# Altium schematic sheet MD070B_POWER_AND_CONNECTORS.SchDoc
size 431 x 279 mm; Date: Not shown in title block; ApprovedBy: Not shown in title block; CheckedBy: Not shown in title block; Author: Not shown in title block; CompanyName: Not shown in title block; Engineer: Not shown in title block; Organization: Not shown in title block; Address1: Not shown in title block; Address2: Not shown in title block; Address3: Not shown in title block; Address4: Not shown in title block; DocumentNumber: 5; Revision: Use project parameter SCH_Rev; SheetNumber: 4; SheetTotal: 5; PageSetup: Record=PageOptions|CenterHorizontal=True|CenterVertical=True|PrintScale=1.00|XCorrection=1.00|YCorrection=1.00|PrintKind=0|BorderSize=5000000|LeftOffset=0|BottomOffset=0|Orientation=2|PaperLength=1000|PaperWidth=1000|Scale=100|PaperSource=15|PrintQuality=600|MediaType=1|DitherType=10|PaperKind=Letter|PrintScaleMode=1; CurrentTime: Not shown in title block; CurrentDate: Not shown in title block; Time: Not shown in title block; DocumentFullPathAndName: Not shown in title block; DocumentName: Not shown in title block; ModifiedDate: Not shown in title block; ImagePath: Not shown in title block
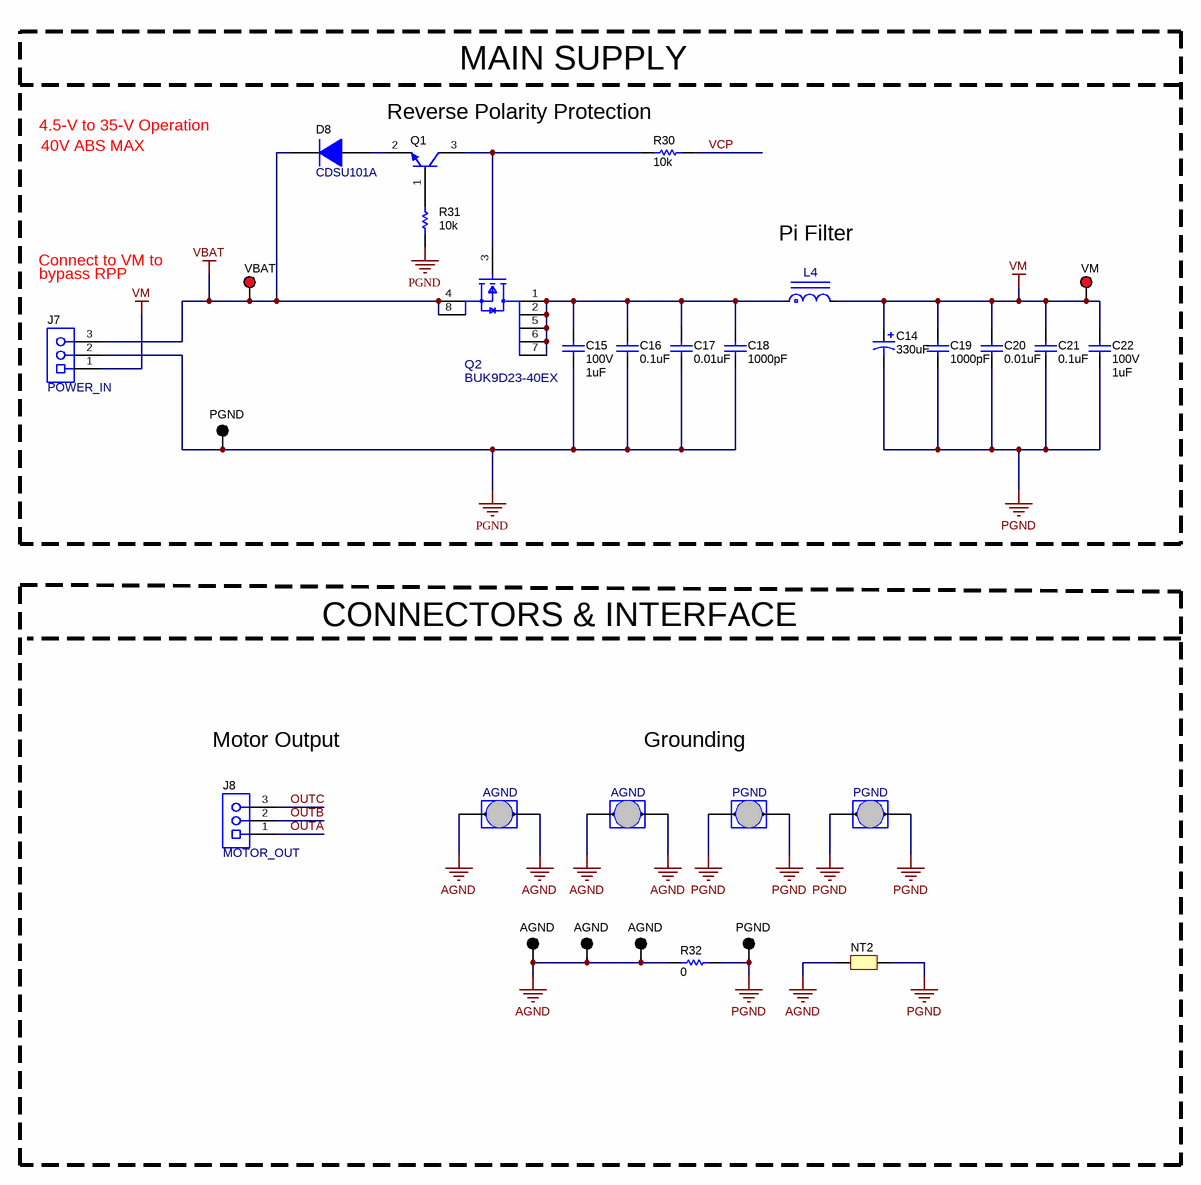
[diagram p0: MD070B_POWER_AND_CONNECTORS.SchDoc]

## Parts
C14  ValueDisplayed: 330uF  [Chemi-Con_1250x2000]  (hidden comment: ELXZ630ELL331MK20S)
C15  VDC_V: 100V  ValueDisplayed: 1uF  [1206_180]  (hidden comment: CL31B105KCHNNNE)
C16  ValueDisplayed: 0.1uF  [0603L]  (hidden comment: CGA3E3X7S2A104K080AB)
C17  ValueDisplayed: 0.01uF  [0603L]  (hidden comment: CGA3E2X7R2A103K080AA)
C18  ValueDisplayed: 1000pF  [0603L]  (hidden comment: CGA3E2X7R2A102K080AA)
C19  ValueDisplayed: 1000pF  [0603L]  (hidden comment: CGA3E2X7R2A102K080AA)
C20  ValueDisplayed: 0.01uF  [0603L]  (hidden comment: CGA3E2X7R2A103K080AA)
C21  ValueDisplayed: 0.1uF  [0603L]  (hidden comment: CGA3E3X7S2A104K080AB)
C22  VDC_V: 100V  ValueDisplayed: 1uF  [1206_180]  (hidden comment: CL31B105KCHNNNE)
D8  CDSU101A  [SOD-523F]
J7  POWER_IN  [On-Shore_ED120_3DS]
J8  MOTOR_OUT  [On-Shore_ED120_3DS]
L4  HCM1A1104V2-1R0-R  [FP-HCM1A1104V2-1R0-R_SMD2-MFG]  (value not drawn)
NT2  Net-Tie  [Net-Tie_50milWide_30milLong]  (value not drawn)  (net tie, no BOM)
Q1  FMMT620TA  [SOT-23L]  (value not drawn)
Q2  BUK9D23-40EX  [FP-BUK9D23-40EX_SOT1220-MFG]
R30  value 10k  [0603L]  (hidden comment: CRCW060310K0JNEA)
R31  value 10k  [0603L]  (hidden comment: CRCW060310K0JNEA)
R32  ValueDisplayed: 0  [1206L]  (hidden comment: RCA12060000ZSEA)
TP23  VBAT  [Keystone5005]
TP24  VM  [Keystone5005]
TP25  PGND  [Keystone5001]
TP26  AGND  [Harwin_D3082-05]
TP27  AGND  [Harwin_D3082-05]
TP28  PGND  [Harwin_D3082-05]
TP29  PGND  [Harwin_D3082-05]
TP30  AGND  [Keystone5001]
TP31  AGND  [Keystone5001]
TP32  AGND  [Keystone5001]
TP33  PGND  [Keystone5001]

## Blocks framed on the sheet
MAIN SUPPLY: C14-C22 D8 J7 L4 Q1 Q2 R30 R31 TP23-TP25
CONNECTORS & INTERFACE: J8 NT2 R32 TP26-TP33

## Nets
AGND: NT2.1 R32.1 TP26.1 TP26.2 TP27.1 TP27.2 TP30.1 TP31.1 TP32.1
PGND: C14.2(-) C15.2 C16.2 C17.2 C18.2 C19.2 C20.2 C21.2 C22.2 J7.2 NT2.2 R31.2 R32.2 TP25.1 TP28.1 TP28.2 TP29.1 TP29.2 TP33.1
VBAT: D8.1(K) J7.3 Q2.4(S) Q2.8(S) TP23.1
VM: C14.1(+) C19.1 C20.1 C21.1 C22.1 J7.1 L4.2 TP24.1
OUTA: J8.1
OUTB: J8.2
OUTC: J8.3
VCP: R30.1
NetC15_1: C15.1 C16.1 C17.1 C18.1 L4.1 Q2.1(D) Q2.2(D) Q2.5(D) Q2.6(D) Q2.7(D)
NetD8_2: D8.2(A) Q1.2(E)
NetQ1_1: Q1.1(B) R31.1
NetQ1_3: Q1.3(C) Q2.3(G) R30.2

## Notes on the sheet
- 40V ABS MAX
- 4.5-V to 35-V Operation
- Reverse Polarity Protection
- bypass RPP
- Connect to VM to
- Pi Filter
- Motor Output
- Grounding
- Drawn By:
- SVN Rev:
- Number:
- TID #:
- Orderable:
- Rev:
- Sheet Title:
- File:
- Project Title:
- Designed for:
- Assembly Variant:
- Mod. Date:
- Sheet:
- Size:
- of
- B
- http://www.ti.com
- Texas Instruments and/or its licensors do not warrant the accuracy or completeness of this specification or any information contained therein. Texas Instruments and/or its licensors do not warrant that this design will meet the specifications, will be suitable for your application or fit for any particular purpose, or will operate in an implementation. Texas Instruments and/or its licensors do not warrant that the design is production worthy. You should completely validate and test your design implementation to confirm the system functionality for your application.
- Engineer:
- Contact:
- © Texas Instruments

## Library data of the parts
C14 = CMP-0009912-2: CAP, AL, 330 uF, 63 V, +/- 20%, AEC-Q200 Grade 2, TH; Manufacturer: Chemi-Con; Polarized: Y; CompType: Capacitor; Value: 330uF; U/M: EA; Cap_F: 330µF; Value1: Unknown; VDC_V: 63V; IRMS_A: 1.29A; TaMin_C: -55°C; TaMax_C: 105°C; Cap_Case: 12.5x20mm; AEC Category: Q200; AEC Grade: 2; SizeAreaWB_mm2: 210.25; SizeArea_mm2: 156.25; SizeX_mm: 12.5; SizeZ_mm: 21.5; PartNumber: ELXZ630ELL331MK20S; PackageReference: D12.5xL20mm; RoHS: Y; Tolerance_%: 20%; Value2: 63V; MountType: TH; Technology: AL; Series: LXZ; Publisher: Texas Instruments; LatestRevisionDate: 2017-03-09; ComponentLink1Description: Datasheet link; ComponentLink1URL: http://www.chemi-con.co.jp/cgi-bin/CAT_DB/SEARCH/cat_db_al.cgi?e=e&j=p&pdfname=lxz; Supplier 1: Digi-Key; Supplier Part Number 1: 565-2043-ND; Supplier 2: Mouser; Supplier Part Number 2: 661-ELXZ630ELL331MK2; AEC Qualified: Y; SizeY_mm: 12.5
C15 C22 = CMP-0008801-2: CAP, CERM, 1 uF, 100 V, +/- 10%, X7R, 1206; Manufacturer: Samsung; TaMin_C: -55°C; Polarized: N; SizeAreaWB_mm2: 10.92; Value1: Unknown; U/M: EA; Value: 1uF; TaMax_C: 125°C; SizeZ_mm: 1.8; SizeX_mm: 3.2; SizeY_mm: 1.6; Cap_Case: 1206; SizeArea_mm2: 5.12; Cap_F: 1µF; AEC Category: Q200; Publisher: Texas Instruments; TempCo: X7R; Published: 2008-06-19; RoHS: Y; MountType: SMT; Supplier 1: Digi-Key; PackageReference: 1206; Tolerance_%: 10%; Value2: 100V; CompType: Capacitor; LatestRevisionDate: 2017-03-09; PartNumber: CL31B105KCHNNNE; AEC Qualified: N; ComponentLink1Description: Datasheet link; AEC Grade: N/A; Supplier Part Number 1: 1276-1838-1-ND; Technology: Ceramic; ComponentLink1URL: http://www.samsungsem.com/kr/front/downloadcms.do?path=/kr/support/product-search/mlcc/__icsFiles/afieldfile/2014/11/05&fileName=C_CL31B105KCHNNNE.pdf
C16 C21 = CMP-0007099-4: CAP, CERM, 0.1 uF, 100 V, +/- 10%, X7S, AEC-Q200 Grade 1, 0603; Manufacturer: TDK; Polarized: N; Value: 0.1uF; U/M: EA; Cap_F: 100nF; ESR_ohm: 0.04959; Value1: 0.04959 ohm; VDC_V: 100V; IRMS_A: 751.618mA; TaMin_C: -55°C; TaMax_C: 125°C; Cap_Case: 0603; AEC Category: Q200; AEC Qualified: Y; AEC Grade: 1; SizeAreaWB_mm2: 4.68; SizeX_mm: 1.6; SizeY_mm: 0.8; SizeArea_mm2: 1.28; CompType: Capacitor; PartNumber: CGA3E3X7S2A104K080AB; PackageReference: 0603; RoHS: Y; Tolerance_%: 10%; Value2: 100V; MountType: SMT; Technology: Ceramic; TempCo: X7S; Published: 2008-06-19; Publisher: Texas Instruments; LatestRevisionDate: 2017-03-09; ComponentLink1Description: Datasheet link; ComponentLink1URL: https://product.tdk.com/en/search/capacitor/ceramic/mlcc/info?part_no=CGA3E3X7S2A104K080AB; Supplier 1: Digi-Key; Supplier Part Number 1: 445-6938-1-ND; Supplier 2: Newark; Supplier Part Number 2: 04X3163; Supplier 3: Mouser; Supplier Part Number 3: 810-CGA3E3X7S2A104K; SizeZ_mm: 1
C17 C20 = CMP-0007082-4: CAP, CERM, 0.01 uF, 100 V, +/- 10%, X7R, AEC-Q200 Grade 1, 0603; Manufacturer: TDK; Polarized: N; Value: 0.01uF; U/M: EA; Cap_F: 10nF; ESR_ohm: 0.235428; Value1: 0.235428 ohm; VDC_V: 100V; IRMS_A: 396.995mA; TaMin_C: -55°C; TaMax_C: 125°C; Cap_Case: 0603; AEC Category: Q200; AEC Qualified: Y; AEC Grade: 1; SizeArea_mm2: 1.28; SizeAreaWB_mm2: 4.68; SizeX_mm: 1.6; SizeY_mm: 0.8; CompType: Capacitor; PartNumber: CGA3E2X7R2A103K080AA; PackageReference: 0603; RoHS: Y; Tolerance_%: 10%; Value2: 100V; MountType: SMT; Technology: Ceramic; TempCo: X7R; Published: 2008-06-19; Publisher: Texas Instruments; LatestRevisionDate: 2017-03-09; ComponentLink1Description: Datasheet link; ComponentLink1URL: https://product.tdk.com/en/search/capacitor/ceramic/mlcc/info?part_no=CGA3E2X7R2A103K080AA; Supplier 1: Digi-Key; Supplier Part Number 1: 445-5812-1-ND; Supplier 2: Mouser; Supplier Part Number 2: 810-CGA3E2X7R2A103K080AA; SizeZ_mm: 1
C18 C19 = CMP-0007081-4: CAP, CERM, 1000 pF, 100 V, +/- 10%, X7R, AEC-Q200 Grade 1, 0603; Manufacturer: TDK; Polarized: N; Value: 1000pF; U/M: EA; Cap_F: 1nF; ESR_ohm: 1.97137; Value1: 1.97137 ohm; VDC_V: 100V; IRMS_A: 305.705mA; TaMin_C: -55°C; TaMax_C: 125°C; Cap_Case: 0603; AEC Category: Q200; AEC Qualified: Y; AEC Grade: 1; SizeArea_mm2: 1.28; SizeAreaWB_mm2: 4.68; SizeX_mm: 1.6; SizeY_mm: 0.8; CompType: Capacitor; PartNumber: CGA3E2X7R2A102K080AA; PackageReference: 0603; RoHS: Y; Tolerance_%: 10%; Value2: 100V; MountType: SMT; Technology: Ceramic; TempCo: X7R; Published: 2008-06-19; Publisher: Texas Instruments; LatestRevisionDate: 2017-03-09; ComponentLink1Description: Datasheet link; ComponentLink1URL: https://product.tdk.com/en/search/capacitor/ceramic/mlcc/info?part_no=CGA3E2X7R2A102K080AA; Supplier 1: Digi-Key; Supplier Part Number 1: 445-5806-1-ND; Supplier 2: Mouser; Supplier Part Number 2: 810-CGA3E2X7R2A102K080AA; SizeZ_mm: 1
D8 = CMP-0076943-3: Diode, Switching, 90 V, 0.1 A, SOD-523F; Manufacturer: Comchip Technology; SizeAreaWB_mm2: 5.13; Vr_V: 90V; SizeArea_mm2: 1.53; TJmax_C: 125°C; AEC Category: Q101; Value: 90V; SizeZ_mm: 0.85; Green_REACh: Incomplete; Io_A: 100mA; Vf_V: 1V; SizeY_mm: 0.9; Green_Lifecycle: Not Set; Value1: 0.1A; SizeX_mm: 1.7; MFG_Status: TI_Obsolete; ComponentLink1Description: Datasheet link; RoHS: Y; AEC Qualified: ?; Green_EU RoHS: Incomplete; PackageReference: SOD-523F; PartNumber: CDSU101A; Value2: 1V; ComponentLink1URL: http://www.comchiptech.com/cms/UserFiles/CDSU101A-RevA371622.pdf; CompType: Diode; MountType: SMT; Type: Switching; Green_EU RoHS-2: Incomplete
J7 J8 = CMP-0074911-1: Terminal Block, 5.08 mm, 3x1, Brass, TH; Manufacturer: On-Shore Technology; PartNumber: ED120/3DS; Cert_VDE: Y; CNHeader: False; Current_A: 15A; Green_Lifecycle: Not Set; Shrouded: N; Gender: Female; Green_REACh: Incomplete; Voltage_V: 300V; Row_Count: 1; Pitch_mm: 5.08; CT: True; ComponentLink1URL: http://www.on-shore.com/sites/default/files/manuals/ed120ds.pdf; Publisher: Texas Instruments; Color: Blue; Cert_CULUS: Y; RoHS: Y; MountType: TH; Green_EU RoHS-2: Incomplete; Supplier 1: Digi-Key; Green_EU RoHS: Incomplete; PackageReference: 3x1 5.08 mm Terminal Block; PinCount: 3; CompType: Terminal Block; LatestRevisionDate: 2017-07-12; Orientation: Vertical; ComponentLink1Description: Datasheet URL; Supplier Part Number 1: ED1610-ND; ContactFinish: Brass
L4 = CMP-0094173-1: 1 µH Shielded - Inductor 19 A 3.1mOhm Max Nonstandard; Manufacturer: Eaton; Isat: 25A; Irms: 19A; DCR_ohm: 3.1m; Material: Alloy powder; Value: 1uH; SizeZ_mm: 4mm; Ind_H: 1µH; AEC Qualified: Yes; AEC Grade: Grade 0; Shrouded: true; Test Frequency: 100kHz; Self Resonant Frequency: 38MHz; Tolerance_%: 20%; ComponentLink1URL: https://www.eaton.com/content/dam/eaton/products/electronic-components/resources/data-sheet/eaton-hcm1a1104v2-automotive-power-inductors-data-sheet.pdf; RoHS: TRUE; PackageReference: SMD2; PartNumber: HCM1A1104V2-1R0-R; ComponentLink1Description: Datasheet; Supplier 1: Digikey; Supplier 2: Mouser; Supplier Part Number 1: 283-HCM1A1104V2-1R0-RCT-ND; Supplier Part Number 2: 504-HCM1A1104V21R0-R; Part Number: HCM1A1104V2-1R0-R; Operating Temperature Range: -55°C to +155°C; datasheet: https://www.eaton.com/content/dam/eaton/products/electronic-components/resources/data-sheet/eaton-hcm1a1104v2-automotive-power-inductors-data-sheet.pdf; Lead Free: Yes; Digikey Part Number: 283-HCM1A1104V2-1R0-RCT-ND; helpURL: https://upverter.com/upn/revision/8b90632ea16fe584/; Digikey Description: FIXED IND 1UH 19A 3.1 MOHM SMD; Mouser Part Number: 504-HCM1A1104V21R0-R; Datasheet Path: datasheets/Ind-HCM1A1104V2-1R0-R.pdf
NT2 = CMP-0078142-4: Single point connection between nets.; CompType: Net-Tie; PackageReference: N/A; Library Reference: Net-Tie; Manufacturer: N/A; PartNumber: N/A; MountType: SMT
Q1 = CMP-0000467-2: Transistor, NPN, 80 V, 1.5 A, AEC-Q101, SOT-23; Manufacturer: Diodes Inc.; TaMax_C: 150°C; Value2: 900; Value1: 1.5 A; Vcesat1_V: 160mV; SizeX_mm: 2.5; SizeY_mm: 3; TaMin_C: -55°C; IcRated_A: 1.5A; CompType: BJT; SizeZ_mm: 1.1; AEC Qualified: Y; Value: 80 V; SizeArea_mm2: 7.5; NPN: 1; Vceo_V: 80V; PNP: 0; AEC Category: Q101; SizeAreaWB_mm2: 14; U/M: EA; Supplier 2: Newark; Supplier 3: Mouser; Supplier 1: Digi-Key; Supplier Part Number 1: FMMT620CT-ND; Supplier Part Number 2: 65T9129; Supplier Part Number 3: 522-FMMT620TA; PartNumber: FMMT620TA; LatestRevisionDate: 2017-03-09; ComponentLink1URL: http://www.diodes.com/datasheets/FMMT620.pdf; Publisher: Texas Instruments; ComponentLink1Description: Datasheet link; HfeMax: 900; Published: 2008-07-31; RoHS: Y; PackageReference: SOT-23; MountType: SMT
Q2 = CMP-0088880-1: N-Channel 40V 8A (Ta) 15W (Tc) Surface Mount DFN2020MD-6; Manufacturer: Nexperia; Reverse Recovery Charge: 5.3nC; Vgs_V: 15V; Rthja Max: 57K/W; Number Of N Channels: 1; Pulse Drain Current: 76A; Threshold Vgs Max: 2.1V; Power_W: 2.3W; Reverse Recovery Time: 12.9ns; TaMin_C: -55°C; Rdson45_ohm: 0.018; SizeZ_mm: 0.65mm; ChMode: False; Transconductance: 39S; AEC Qualified: Yes; Typ Forward Diode Voltage: 0.8V; Turn Off Delay Time: 12ns; TaMax_C: +175°C; Input Capacitace At Vds: 637pF @ 20V; QgTyp_nC: 11.5nC @ 10V; Threshold Vgs Min: 1.4V; AEC Grade: Grade 0; VdsMax_V: 1.2V; Turn On Delay Time: 2ns; Device Class L1: Discrete Semiconductors; PartNumber: BUK9D23-40EX; PackageReference: SOT1220; Digikey Description: MOSFET N-CH 40V 8A 6DFN2020MD; Mouser Part Number: 771-BUK9D23-40EX; RoHS: TRUE; Device Class L2: Transistors; ComponentLink1URL: https://assets.nexperia.com/documents/data-sheet/BUK9D23-40E.pdf; Lead Free: Yes; IdsMax_A: 8A; ComponentLink1Description: Datasheet; Operating Temperature Range: -55°C to +175°C; Digikey Part Number: 1727-7413-1-ND; datasheet: https://assets.nexperia.com/documents/data-sheet/BUK9D23-40E.pdf; Part Number: BUK9D23-40EX; Number Of Channels: 1; Datasheet Path: datasheets/Trans-BUK9D23-40EX.pdf; helpURL: https://upverter.com/upn/revision/bf3b926f6919405d/; Device Class L3: MOSFETs; Drain To Source Breakdown Voltage: 40V; TJmax_C: +175°C
R30 R31 = CMP-0025701-4: RES, 10 k, 5%, 0.1 W, AEC-Q200 Grade 0, 0603; Manufacturer: Vishay-Dale; Value_Code: 10k0; Power_W: 100mW; Value2: 0.1W; VDC_V: 75V; TempCo: 200 ppm/C; EIA_Code: E24; AEC Category: Q200; AEC Qualified: Y; AEC Grade: 0; SizeArea_mm2: 1.28; SizeX_mm: 1.6; SizeY_mm: 0.8; SizeZ_mm: 1; CompType: Resistor; PartNumber: CRCW060310K0JNEA; PackageReference: 0603; RoHS: E; Res_ohm: 10k; Tolerance_%: 5%; Value1: 5%; MountType: SMT; Technology: Thick Film; ComponentLink1Description: Datasheet link; ComponentLink1URL: http://www.vishay.com/docs/20035/dcrcwe3.pdf; Supplier 1: Digi-Key; Supplier Part Number 1: 541-10KGCT-ND; Supplier 2: Newark; Supplier Part Number 2: 52K8066; Supplier 3: Mouser; Supplier Part Number 3: 71-CRCW0603J-10K-E3; ValueDisplayed: 10k
R32 = CMP-0018760-2: RES, 0, 5%, 0.25 W, AEC-Q200 Grade 0, 1206; Manufacturer: Vishay-Dale; Power_W: 250mW; TempCo: ppm/C; Value_Code: 0000; U/M: EA; Value: 0; EIA_Code: E24; SizeX_mm: 3.2; SizeY_mm: 1.6; SizeZ_mm: 1.35; Value2: 0.25W; SizeArea_mm2: 5.12; AEC Qualified: Y; AEC Category: Q200; ComponentLink1URL: http://www.vishay.com/docs/20037/rcae3.pdf; Supplier Part Number 2: 98Y2329; Publisher: Texas Instruments; Supplier 2: Newark; Supplier Part Number 3: 2616593; Supplier 3: Farnell; Published: 2008-06-26; RoHS: Y; Value1: 5%; MountType: SMT; Supplier 1: Digi-Key; PackageReference: 1206; Tolerance_%: 5%; Res_ohm: 0; CompType: Resistor; LatestRevisionDate: 2017-03-09; PartNumber: RCA12060000ZSEA; ComponentLink1Description: Datasheet link; AEC Grade: 0; Supplier Part Number 1: 541-2239-1-ND; Technology: Thick Film
TP23 TP24 = CMP-0055142-1: Test Point, Compact, Red, TH; Manufacturer: Keystone; CNHeader: FALSE; ContactFinish: Silver; CT: TRUE; Green_Lifecycle: Active; Green_REACh: Passed; PartNumber: 5005; PackageReference: Red Compact Testpoint; CompType: Test Point; RoHS: Y; MountType: TH; ComponentLink1Description: Datasheet URL; ComponentLink1URL: http://www.keyelco.com/userAssets/file/M60-2p60.pdf; Publisher: Texas Instruments; LatestRevisionDate: 26/05/2017; Supplier 1: Digi-Key; Supplier Part Number 1: 36-5005-ND; Supplier 2: Mouser; Supplier Part Number 2: 534-5005; Color: Red; Green_EU RoHS-2: Passed; Green_EU RoHS: Passed
TP25 TP30-TP33 = CMP-0055138-1: Test Point, Miniature, Black, TH; Manufacturer: Keystone; CNHeader: FALSE; Green_Lifecycle: Active; Green_REACh: Passed; ContactFinish: Silver; CT: TRUE; ComponentLink1URL: http://www.keyelco.com/userAssets/file/M60-2p60.pdf; Supplier Part Number 2: 534-5001; Publisher: Texas Instruments; Supplier 2: Mouser; Color: Black; RoHS: Y; MountType: TH; Green_EU RoHS-2: Incomplete; Supplier 1: Digi-Key; Green_EU RoHS: Passed; PackageReference: Black Miniature Testpoint; CompType: Test Point; LatestRevisionDate: 26/05/2017; PartNumber: 5001; ComponentLink1Description: Datasheet URL; Supplier Part Number 1: 36-5001-ND
TP26-TP29 = CMP-0075110-1: 1mm Uninsulated Shorting Plug, 10.16mm spacing, TH; Manufacturer: Harwin; PartNumber: D3082-05; CNHeader: False; Green_Lifecycle: Active; Green_REACh: Passed; CompType: Jumper Wire; ComponentLink1URL: http://cdn.harwin.com/pdfs/D3080-D3083.pdf; Supplier Part Number 2: 01E9240; Publisher: Texas Instruments; Supplier 2: Newark; Supplier Part Number 3: 855-D3082-05; Supplier 3: Mouser; RoHS: Y; MountType: TH; Green_EU RoHS-2: Passed; Supplier 1: Digi-Key; Green_EU RoHS: Passed with Exemption; PackageReference: Shorting Plug, 10.16mm spacing, TH; LatestRevisionDate: 2017-07-12; ComponentLink1Description: Datasheet URL; Supplier Part Number 1: 952-1873-ND; CT: False